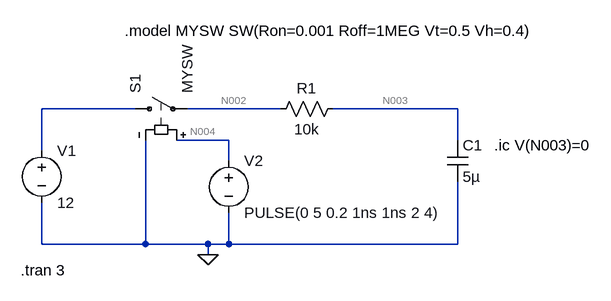
[diagram p0: schematic Transient_RC.asc]
Transient_RC.asc, the LTspice schematic file:
Version 4
SHEET 1 880 680
WIRE 32 96 -112 96
WIRE 256 96 112 96
WIRE 528 96 336 96
WIRE 176 144 96 144
WIRE 528 144 528 96
WIRE -112 160 -112 96
WIRE 176 176 176 144
WIRE -112 304 -112 240
WIRE 48 304 48 144
WIRE 48 304 -112 304
WIRE 144 304 48 304
WIRE 176 304 176 256
WIRE 176 304 144 304
WIRE 528 304 528 208
WIRE 528 304 176 304
WIRE 144 320 144 304
FLAG 144 320 0
SYMBOL res 352 80 R90
WINDOW 0 0 56 VBottom 2
WINDOW 3 32 56 VTop 2
SYMATTR InstName R1
SYMATTR Value 10k
SYMBOL cap 512 144 R0
SYMATTR InstName C1
SYMATTR Value 5µ
SYMBOL voltage -112 144 R0
SYMATTR InstName V1
SYMATTR Value 12
SYMBOL sw 16 96 R270
SYMATTR InstName S1
SYMATTR Value MYSW
SYMBOL voltage 176 160 R0
WINDOW 123 0 0 Left 0
WINDOW 39 0 0 Left 0
SYMATTR InstName V2
SYMATTR Value PULSE(0 5 0.2 1ns 1ns 2 4)
TEXT 584 152 Left 2 !.ic V(N003)=0
TEXT 16 -24 Left 2 !.model MYSW SW(Ron=0.001 Roff=1MEG Vt=0.5 Vh=0.4)
TEXT -144 344 Left 2 !.tran 3

The netlist it stands for:
* Transient_RC.asc
R1 N003 N002 10k
C1 N003 0 5µ
V1 N001 0 12
S1 N001 N002 N004 0 MYSW
V2 N004 0 PULSE(0 5 0.2 1ns 1ns 2 4)
.ic V(N003)=0
.model MYSW SW(Ron=0.001 Roff=1MEG Vt=0.5 Vh=0.4)
.tran 3
.backanno
.end

* Results of the author's LTspice run, read from the files saved beside the schematic
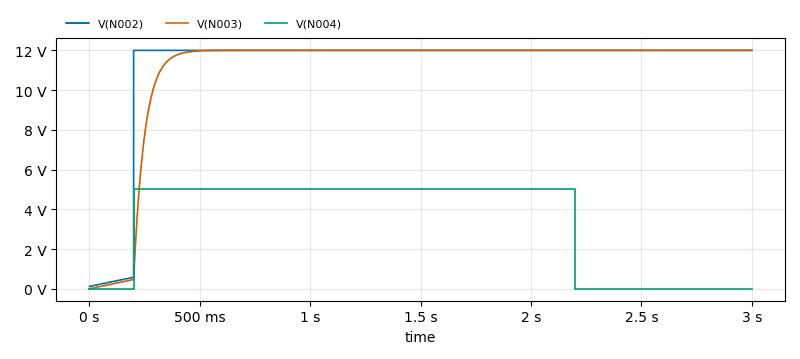
[diagram p1: Transient Analysis of Transient_RC.asc, plotted from the saved traces]
* Transient Analysis, 1 run:
*   V(N002): min 118.8 mV, max 12 V, average 11.22 V, rms 11.59 V, last 12 V
*   V(N003): min 0 V, max 12 V, average 11.02 V, rms 11.44 V, last 12 V
*   V(N004): min 0 V, max 5 V, average 3.333 V, rms 4.082 V, last 0 V